# EAGLE design Narrow AAA sensor v2 (EAGLE 8.1.0)
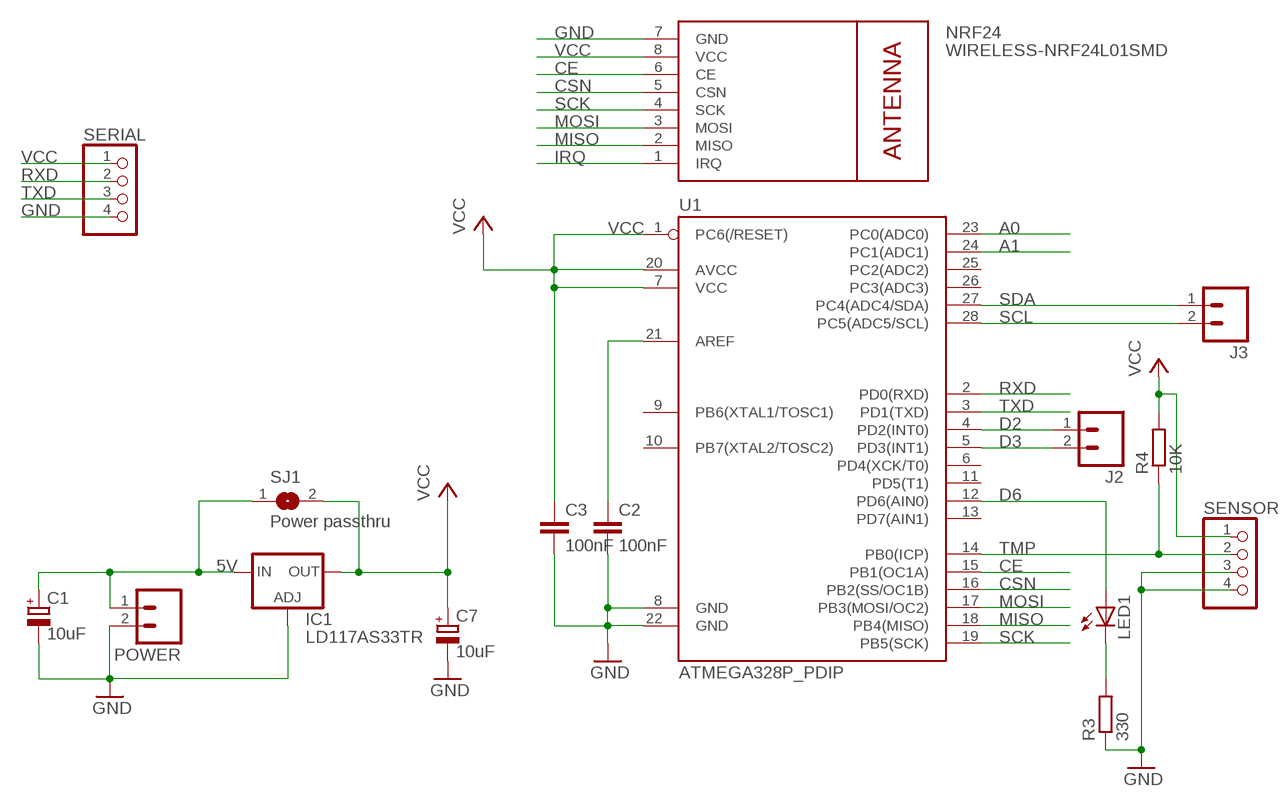
[diagram p0: schematic, sheet 1]

## Parts
C1  10uF  CPOL-EUE2.5-5  [E2,5-5]
C2  100nF  C-EU025-025X050  [C025-025X050]
C3  100nF  C-EU025-025X050  [C025-025X050]
C7  10uF  CPOL-EUE2.5-5  [E2,5-5]
IC1  LD117AS33TR  [SOT223]
J2  M02PTH  [1X02]
J3  M021X02_NO_SILK  [1X02_NO_SILK]
LED1  LED3MM  [LED3MM]
NRF24  WIRELESS-NRF24L01SMD  [WIRELESS-NRF24L01-SMD]
POWER  M021X02_NO_SILK  [1X02_NO_SILK]
R3  330  R-EU_0204/7  [0204/7]
R4  10K  R-EU_0204/7  [0204/7]
SENSOR  PINHD-1X4  [1X04]
SERIAL  PINHD-1X4  [1X04]
SJ1  Power passthru  SJ  [SJ]
U1  ATMEGA328P_PDIP  [DIL28-3]

## Nets
5V: C1.+ IC1.3(IN) POWER.1 SJ1.1
A0: U1.23(PC0(ADC0))
A1: U1.24(PC1(ADC1))
CE: NRF24.6(CE) U1.15(PB1(OC1A))
CSN: NRF24.5(CSN) U1.16(PB2(SS/OC1B))
D2: J2.1 U1.4(PD2(INT0))
D3: J2.2 U1.5(PD3(INT1))
D6: LED1.A U1.12(PD6(AIN0))
GND [power]: C1.- C2.2 C3.2 C7.- IC1.1(ADJ) NRF24.7(GND) POWER.2 R3.1 SENSOR.3 SENSOR.4 SERIAL.4 U1.8(GND) U1.22(GND)
IRQ: NRF24.1(IRQ)
MISO: NRF24.2(MISO) U1.18(PB4(MISO))
MOSI: NRF24.3(MOSI) U1.17(PB3(MOSI/OC2))
N$1: LED1.K(C) R3.2
N$8: C2.1 U1.21(AREF)
RXD: SERIAL.2 U1.2(PD0(RXD))
SCK: NRF24.4(SCK) U1.19(PB5(SCK))
SCL: J3.2 U1.28(PC5(ADC5/SCL))
SDA: J3.1 U1.27(PC4(ADC4/SDA))
TMP: R4.1 SENSOR.2 U1.14(PB0(ICP))
TXD: SERIAL.3 U1.3(PD1(TXD))
VCC [power]: C3.1 C7.+ IC1.4(OUT) NRF24.8(VCC) R4.2 SENSOR.1 SERIAL.1 SJ1.2 U1.1(PC6(/RESET)) U1.7(VCC) U1.20(AVCC)
Unconnected: U1.6(PD4(XCK/T0)) U1.9(PB6(XTAL1/TOSC1)) U1.10(PB7(XTAL2/TOSC2)) U1.11(PD5(T1)) U1.13(PD7(AIN1)) U1.25(PC2(ADC2)) U1.26(PC3(ADC3))

## Library data of the parts
C1 C7 = rcl:CPOL-EU: POLARIZED CAPACITOR, European symbol
C2 C3 = GertSanders:C-EU: CAPACITOR, European symbol
IC1 = v-reg:LD117A?*: Low drop fixed and adjustable positive voltage regulators 1 A Source: http://www.st.com/stonline/products/literature/ds/7194/ld1117axx.pdf
J2 J3 POWER = SparkFun-Connectors:M02: Standard 2-pin 0.1" header. Use with - straight break away headers ( PRT-00116) - right angle break away headers (PRT-00553) - swiss pins (PRT-00743) - machine pins (PRT-00117) - female headers (PRT-00115) Molex polarized connector foot print use with: PRT-08233 with associated crimp pins and housings. 2.54_SCREWTERM for use with PRT-10571. 3.5mm Screw Terminal footprints for PRT-08084 5mm Screw Terminal footprints for use with PRT-08432
LED1 = adafruit:LED: LED OSRAM: - CHIPLED LG R971, LG N971, LY N971, LG Q971, LY Q971, LO R971, LY R971 LH N974, LH R974 LS Q976, LO Q976, LY Q976 LO Q996 - Hyper CHIPLED LW Q18S LB Q993, LB Q99A, LB R99A - SideLED LS A670, LO A670, LY A670, LG A670, LP A670 LB A673, LV A673, LT A673, LW A673 LH A674 LY A675 LS A676, LA A676, LO A676, LY A676, LW A676 LS A679, LY A679, LG A679 - Hyper Micro SIDELED® LS Y876, LA Y876, LO Y876, LY Y876 LT Y87S - SmartLED LW L88C, LW L88S LB L89C, LB L89S, LG L890 LS L89K, LO L89K, LY L89K LS L896, LA L896, LO L896, LY L896 - TOPLED LS T670, LO T670, LY T670, LG T670, LP T670 LSG T670, LSP T670, LSY T670, LOP T670, LYG T670 LG T671, LOG T671, LSG T671 LB T673, LV T673, LT T673, LW T673 LH T674 LS T676, LA T676, LO T676, LY T676, LB T676, LH T676, LSB T676, LW T676 LB T67C, LV T67C, LT T67C, LS T67K, LO T67K, LY T67K, LW E67C LS E67B, LA E67B, LO E67B, LY E67B, LB E67C, LV E67C, LT E67C LW T67C LS T679, LY T679, LG T679 LS T770, LO T770, LY T770, LG T770, LP T770 LB T773, LV T773, LT T773, LW T773 LH T774 LS E675, LA E675, LY E675, LS T675 LS T776, LA T776, LO T776, LY T776, LB T776 LHGB T686 LT T68C, LB T68C - Hyper Mini TOPLED® LB M676 - Mini TOPLED Santana® LG M470 LS M47K, LO M47K, LY M47K Source: http://www.osram.convergy.de/
NRF24 = GertSanders:WIRELESS-NRF24L01: 2.4 GHz Wireless Module based on NRF24L01 chip
R3 R4 = rcl:R-EU_: RESISTOR, European symbol
SENSOR SERIAL = pinhead:PINHD-1X4: PIN HEADER
SJ1 = jumper:SJ: SMD solder JUMPER
U1 = GertSanders:ATMEGA328P_PDIP: uC used in the Arduino 32kb flash, 1k EEPROM, 2k SRAM This is the through-hole version of this chip.

## Net classes
1 power: width 0.356 mm, clearance 0.178 mm

## Board
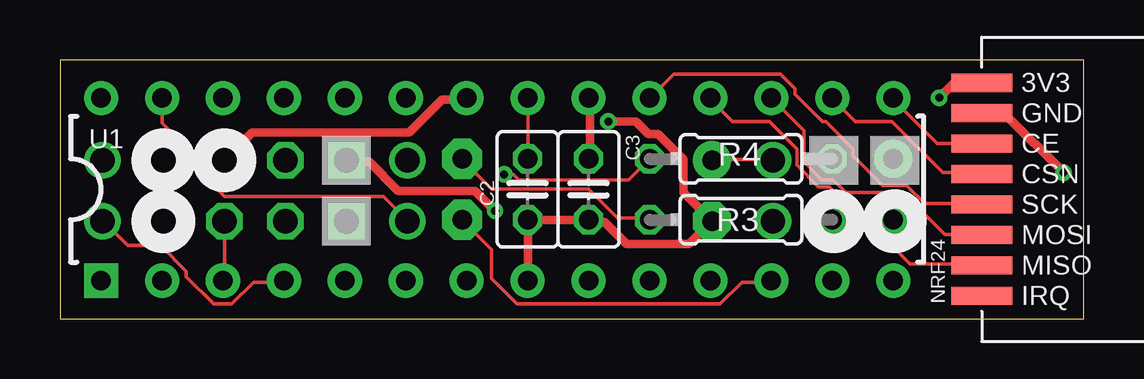
[diagram p1: board, top side]
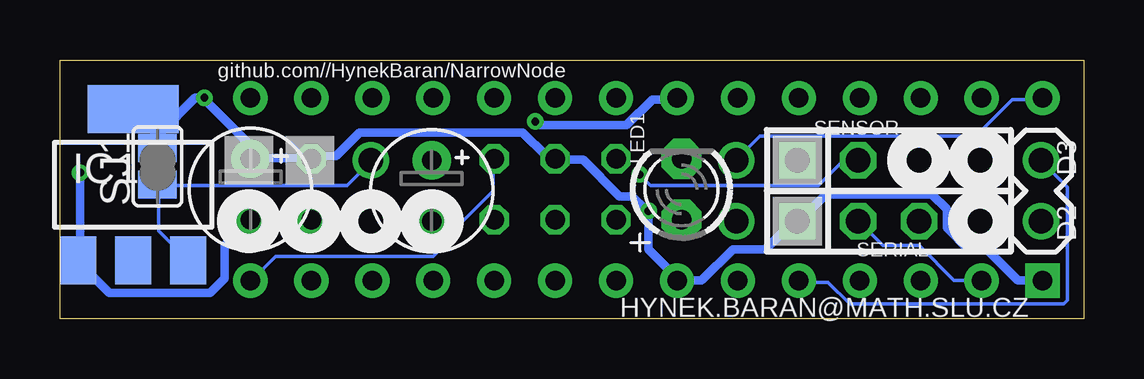
[diagram p2: board, bottom side, seen from below]

Size 42.67 x 10.79 mm. Coordinates in mm from the lower left corner, seen from the top.
Outline: 0,0 42.67,0 42.67,10.79 0,10.79 0,0
Copper layers (1*16): Top 0.0356mm / dielectric 1.5011mm / Bottom 0.0356mm
Design rules "oshpark-2layer": minimum track width 6mil, minimum drill 13mil, track to track 6mil, track to pad 6mil, pad to pad 6mil, via to via 6mil, smd to smd 6mil, copper to edge 15mil, drill to drill 6mil, minimum pad ring 7mil, minimum via ring 7mil, stop-mask expansion 2.5mil, vias tented up to drill 0mil, thermal gap 10mil

### Footprints (pad centres in the part's own frame; a part is rotated, then mirrored left to right if it is on the bottom)
E2,5-5 = drill 0.813 pad 1.6: + -1.27,0 | drill 0.813 pad 1.6 octagon: - 1.27,0
C025-025X050 = drill 0.813 octagon: 1 -1.27,0; 2 1.27,0
SOT223 = smd 1.5 x 2: 1 -2.3,-3.15; 2 0,-3.15; 3 2.3,-3.15 | smd 3.8 x 2: 4 0,3.15
1X02 = drill 1.016 pad 1.422: 1 0,0; 2 2.54,0
1X02_NO_SILK = drill 1.016 pad 1.422: 1 0,0; 2 2.54,0
LED3MM = drill 0.813 pad 1.676 octagon: A -1.27,0; K 1.27,0
WIRELESS-NRF24L01-SMD = smd 2.54 x 0.762: 1 1.27,0; 2 1.27,1.27; 3 1.27,2.54; 4 1.27,3.81; 5 1.27,5.08; 6 1.27,6.35; 7 1.27,7.62; 8 1.27,8.89
0204/7 = drill 0.813 octagon: 1 -3.81,0; 2 3.81,0
1X04 = drill 1.016 square: 1 -3.81,0 | drill 1.016 octagon: 2 -1.27,0; 3 1.27,0; 4 3.81,0
SJ = smd 1.168 x 1.6: 1 -0.762,0; 2 0.762,0
DIL28-3 = drill 0.813 pad 1.422 square: 1 -16.51,-3.81 | drill 0.813 pad 1.422: 2 -13.97,-3.81; 3 -11.43,-3.81; 4 -8.89,-3.81; 5 -6.35,-3.81; 6 -3.81,-3.81; 7 -1.27,-3.81; 8 1.27,-3.81; 9 3.81,-3.81; 10 6.35,-3.81; 11 8.89,-3.81; 12 11.43,-3.81; 13 13.97,-3.81; 14 16.51,-3.81; 15 16.51,3.81; 16 13.97,3.81; 17 11.43,3.81; 18 8.89,3.81; 19 6.35,3.81; 20 3.81,3.81; 21 1.27,3.81; 22 -1.27,3.81; 23 -3.81,3.81; 24 -6.35,3.81; 25 -8.89,3.81; 26 -11.43,3.81; 27 -13.97,3.81; 28 -16.51,3.81

### Placement (x,y rotation side)
C1  27.18,5.33 270 bottom
C2  19.49,5.4 270 top
C3  22.03,5.4 270 top
C7  34.73,5.4 270 bottom
IC1  39.62,5.59 0 bottom
J2  1.78,4.06 90 bottom
J3  14.48,4.06 90 top
LED1  16.76,5.4 90 bottom
NRF24  37.15,0.95 0 top
POWER  29.72,6.6 270 top
R3  28.38,4.13 180 top
R4  28.38,6.67 0 top
SENSOR  8.13,6.6 0 bottom
SERIAL  8.13,4.06 0 bottom
SJ1  38.61,6.35 90 bottom
U1  18.22,5.4 0 top

### Tracks (layer width: path | path; a pad name or v marks a point on that pad's centre or on a via)
5V
  Top 0.152: POWER.1 29.72,6.63 27.2,6.63 C1.+
  Bottom 0.152: IC1.3 37.34,2.44 38.56,3.66 38.56,5.56 SJ1.1 38.48,5.56 30.71,5.56 29.72,6.55 POWER.1
CE
  Top 0.152: NRF24.6 38.41,7.32 36.58,7.32 34.75,9.14 U1.15
CSN
  Top 0.152: NRF24.5 38.41,6.1 36.8,6.1 34.67,8.23 33.15,8.23 32.23,9.14 U1.16
D2
  Top 0.152: U1.4 9.3,1.52 8.08,1.52 7.16,0.61 6.4,0.61 5.26,1.75 5.26,1.98 4.19,3.05 2.82,3.05 1.83,4.04 J2.1
D3
  Bottom 0.152: U1.5 11.81,1.52 10.67,1.52 9.75,0.61 0.84,0.61 0.69,0.76 0.69,5.49 1.75,6.55 J2.2
D6
  Top 0.152: U1.12 29.64,1.52 28.42,1.52 27.51,0.61 19.05,0.61 17.98,1.68 17.98,2.9 16.76,4.12 LED1.A
GND  (via drill 0.33)
  Top 0.356: SERIAL.4 4.34,4.12 4.34,6.55 SENSOR.4 | U1.22 16.92,9.14 15.93,9.14 14.55,7.77 8,7.77 6.86,6.63 SENSOR.3 | U1.8 19.51,1.6 19.51,3.96 C2.2 19.51,4.12 22.02,4.12 C3.2 22.17,4.04 22.71,4.04 23.62,3.12 26.21,3.12 27.13,4.04 C1.- 25.98,5.26 25.98,6.63 24.92,7.7 24.54,7.7 24,8.23 v22.86,8.23 | v41.83,6.1 39.39,8.53 38.48,8.53 NRF24.7
  Bottom 0.356: SENSOR.4 4.34,6.63 6.86,6.63 SENSOR.3 | v41.83,6.1 41.83,2.59 IC1.1 41.91,2.36 40.61,1.07 36.42,1.07 35.81,1.68 35.81,3.05 C7.- 34.59,4.12 32.23,4.12 R3.1 32,4.12 29.72,4.12 POWER.2 29.57,4.12 27.2,4.12 C1.- | v22.86,8.23 22.71,8.08 19.05,8.08 17.98,9.14 16.99,9.14 U1.22
MISO
  Top 0.152: NRF24.2 38.41,2.29 35.43,2.29 34.67,3.05 34.29,3.05 33.07,4.27 33.07,4.5 32.08,5.49 31.62,5.49 30.71,6.4 30.71,7.09 29.57,8.23 28.04,8.23 27.13,9.14 U1.18
MOSI
  Top 0.152: U1.17 31.01,7.85 31.01,6.55 31.77,5.79 32.23,5.79 32.77,5.26 35.13,5.26 36.88,3.5 38.41,3.5 NRF24.3
N$1
  Top 0.152: R3.2 24.54,4.19 23.24,4.19 22.02,5.41 17.98,5.41 16.76,6.63 LED1.K
N$8
  Top 0.152: C2.1 19.51,6.71 19.51,9.14 U1.21
RXD
  Bottom 0.152: SERIAL.2 8.38,3.05 6.86,3.05 5.41,1.6 4.27,1.6 U1.2
SCK
  Top 0.152: NRF24.4 38.41,4.8 36.04,4.8 35.28,5.56 34.29,5.56 33.07,6.78 33.07,7.09 31.93,8.23 31.77,8.23 30.63,9.37 30.63,9.6 30.02,10.21 25.6,10.21 24.61,9.22 U1.19
SCL
  Bottom 0.152: U1.28 1.75,9.14 2.97,9.14 4.5,7.62 13.49,7.62 14.48,6.63 J3.2
SDA
  Top 0.152: U1.27 4.27,9.14 4.27,8.15 5.79,6.63 5.79,6.17 6.86,5.11 13.49,5.11 14.48,4.12 J3.1
TMP  (via drill 0.33)
  Top 0.152: v18.52,6.02 18.9,6.02 19.13,5.79 23.7,5.79 R4.1
  Bottom 0.152: R4.1 24.61,6.63 24.61,5.33 26.06,3.89 26.06,3.66 27.13,2.59 33.68,2.59 34.67,1.6 U1.14 | v18.52,6.02 18.06,5.56 11.05,5.56 10.06,6.55 9.45,6.55 SENSOR.2
TXD
  Top 0.152: SERIAL.3 6.86,1.6 U1.3
VCC  (via drill 0.33)
  Top 0.356: v36.65,9.22 37.26,9.83 38.41,9.83 NRF24.8 | C3.1 22.1,6.71 22.1,9.14 U1.20 | v18.14,4.5 17.3,5.33 14.1,5.33 12.88,6.55 11.96,6.55 SENSOR.1
  Bottom 0.356: SJ1.2 38.63,7.16 38.63,7.7 39.62,8.69 IC1.4 38.48,7.77 37.03,9.22 v36.65,9.22 36.58,9.07 34.75,7.24 34.75,6.86 C7.+ 34.67,6.71 32.23,6.71 R4.2 32.08,6.78 31.17,6.78 30.17,7.77 23.39,7.77 22.4,6.78 22.17,6.78 C3.1 22.02,6.63 20.88,6.63 19.35,5.11 18.82,5.11 18.29,4.57 v18.14,4.5 18.14,2.9 16.99,1.75 U1.7 16.92,1.6 15.93,1.6 14.63,2.9 13.26,2.9 12.12,4.04 SERIAL.1 11.89,4.04 10.74,5.18 6.32,5.18 5.71,4.57 5.71,3.81 4.8,2.9 4.04,2.9 2.74,1.6 1.75,1.6 U1.1

### Text on the board
bPlace: D3 | D2
bNames: github.com//HynekBaran/NarrowNode | HYNEK.BARAN@MATH.SLU.CZ